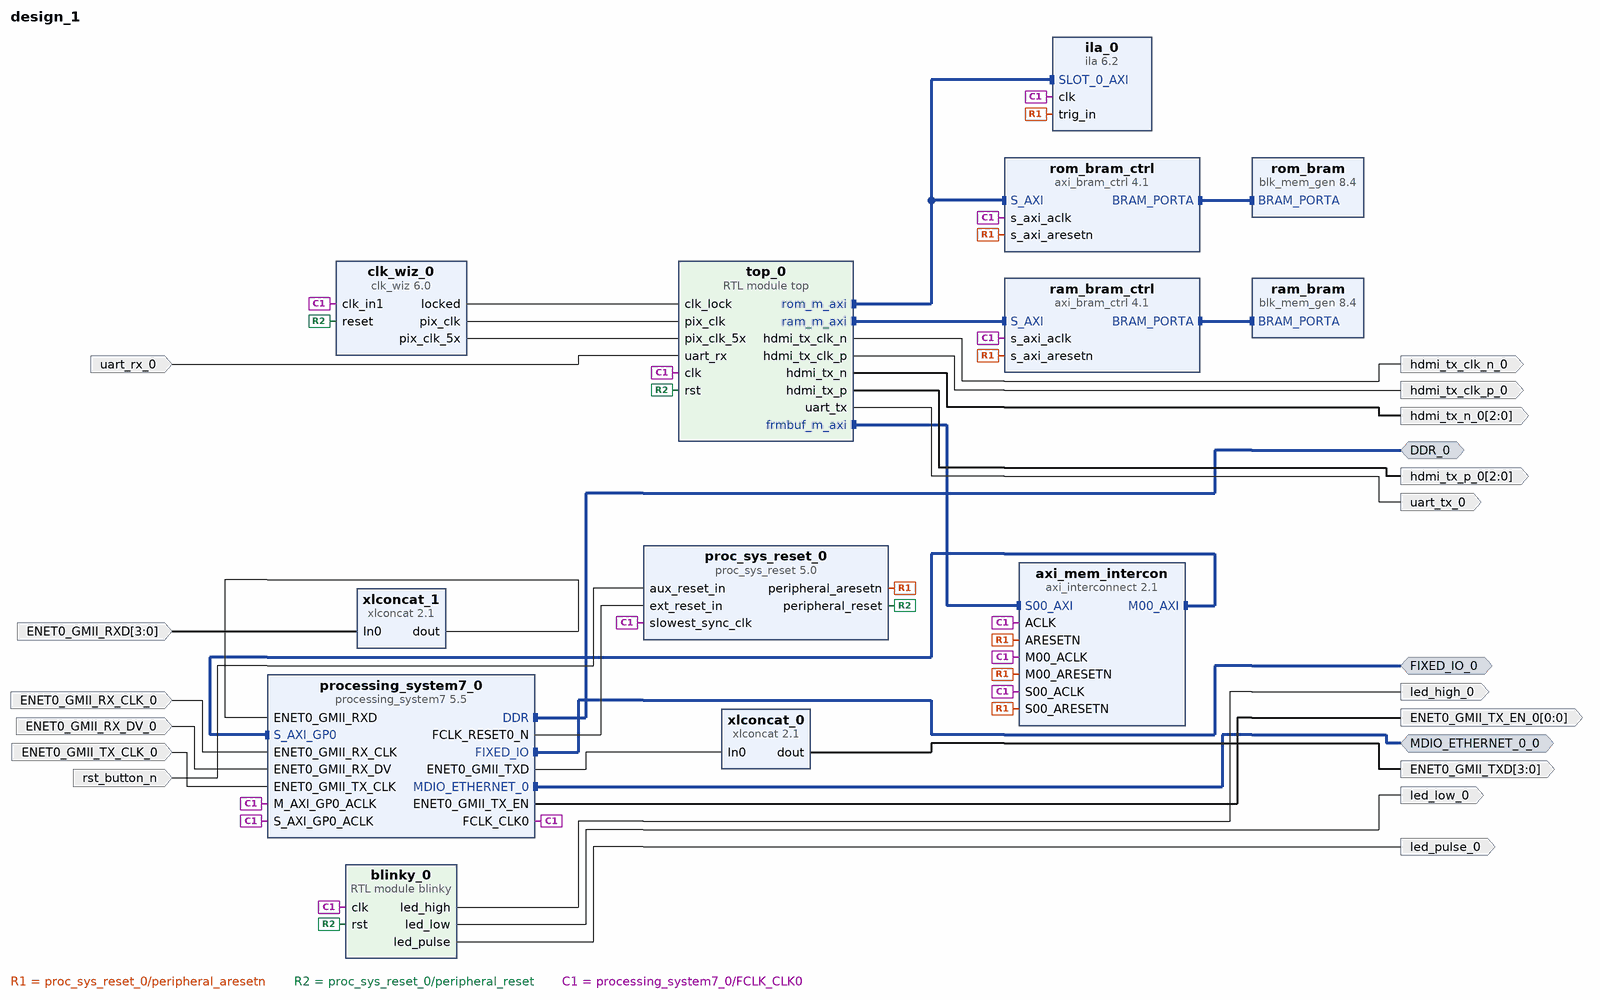
[diagram p0: block diagram of the top level]
# Vivado block design design_1, xc7z010clg400-1, Vivado 2022.2
create_bd_design design_1

create_bd_intf_port -mode Master -vlnv xilinx.com:interface:ddrx_rtl:1.0 DDR_0
create_bd_intf_port -mode Master -vlnv xilinx.com:display_processing_system7:fixedio_rtl:1.0 FIXED_IO_0
create_bd_intf_port -mode Master -vlnv xilinx.com:interface:mdio_rtl:1.0 MDIO_ETHERNET_0_0
create_bd_port -dir I -from 3 -to 0 ENET0_GMII_RXD
create_bd_port -dir I -type clk ENET0_GMII_RX_CLK_0
create_bd_port -dir I ENET0_GMII_RX_DV_0
create_bd_port -dir O -from 3 -to 0 ENET0_GMII_TXD
create_bd_port -dir I -type clk ENET0_GMII_TX_CLK_0
create_bd_port -dir O -from 0 -to 0 ENET0_GMII_TX_EN_0
create_bd_port -dir I uart_rx_0
create_bd_port -dir O uart_tx_0
create_bd_port -dir I -type rst rst_button_n
create_bd_port -dir O led_high_0
create_bd_port -dir O led_pulse_0
create_bd_port -dir O led_low_0
create_bd_port -dir O -from 2 -to 0 hdmi_tx_n_0
create_bd_port -dir O -type clk hdmi_tx_clk_p_0
create_bd_port -dir O -type clk hdmi_tx_clk_n_0
create_bd_port -dir O -from 2 -to 0 hdmi_tx_p_0

create_bd_cell -type ip -vlnv xilinx.com:ip:processing_system7:5.5 processing_system7_0
set_property -dict [list \
  CONFIG.PCW_ENET0_ENET0_IO EMIO \
  CONFIG.PCW_ENET0_GRP_MDIO_ENABLE 1 \
  CONFIG.PCW_ENET0_GRP_MDIO_IO EMIO \
  CONFIG.PCW_ENET0_PERIPHERAL_ENABLE 1 \
  CONFIG.PCW_ENET0_PERIPHERAL_FREQMHZ {100 Mbps} \
  CONFIG.PCW_GPIO_MIO_GPIO_ENABLE 0 \
  CONFIG.PCW_NAND_NAND_IO {MIO 0 2.. 14} \
  CONFIG.PCW_NAND_PERIPHERAL_ENABLE 1 \
  CONFIG.PCW_SD0_GRP_CD_ENABLE 0 \
  CONFIG.PCW_SD0_GRP_WP_ENABLE 0 \
  CONFIG.PCW_SD0_PERIPHERAL_ENABLE 1 \
  CONFIG.PCW_SD0_SD0_IO {MIO 40 .. 45} \
  CONFIG.PCW_SDIO_PERIPHERAL_FREQMHZ 100 \
  CONFIG.PCW_TTC0_PERIPHERAL_ENABLE 1 \
  CONFIG.PCW_TTC0_TTC0_IO EMIO \
  CONFIG.PCW_UART1_PERIPHERAL_ENABLE 1 \
  CONFIG.PCW_UART1_UART1_IO {MIO 24 .. 25} \
  CONFIG.PCW_UART_PERIPHERAL_FREQMHZ 100 \
  CONFIG.PCW_UIPARAM_DDR_BUS_WIDTH {16 Bit} \
  CONFIG.PCW_UIPARAM_DDR_PARTNO {MT41K128M16 HA-15E} \
  CONFIG.PCW_USE_S_AXI_GP0 1 \
] [get_bd_cells processing_system7_0]
# 115 more settings of processing_system7_0 are not shown: defaults, MIO pin electricals, DDR timing, and values the tool derives
create_bd_cell -type ip -vlnv xilinx.com:ip:xlconcat:2.1 xlconcat_0
set_property -dict {CONFIG.IN0_WIDTH 4 CONFIG.NUM_PORTS 1} [get_bd_cells xlconcat_0]
create_bd_cell -type ip -vlnv xilinx.com:ip:xlconcat:2.1 xlconcat_1
set_property -dict {CONFIG.IN0_WIDTH 4 CONFIG.IN1_WIDTH 4} [get_bd_cells xlconcat_1]
create_bd_cell -type ip -vlnv xilinx.com:ip:axi_bram_ctrl:4.1 rom_bram_ctrl
set_property -dict {CONFIG.SINGLE_PORT_BRAM 1} [get_bd_cells rom_bram_ctrl]
create_bd_cell -type ip -vlnv xilinx.com:ip:axi_bram_ctrl:4.1 ram_bram_ctrl
set_property -dict {CONFIG.SINGLE_PORT_BRAM 1} [get_bd_cells ram_bram_ctrl]
create_bd_cell -type ip -vlnv xilinx.com:ip:blk_mem_gen:8.4 rom_bram
set_property -dict [list \
  CONFIG.Coe_File ../../../../../../../rom2.coe \
  CONFIG.Load_Init_File true \
  CONFIG.Memory_Type Single_Port_ROM \
] [get_bd_cells rom_bram]
create_bd_cell -type ip -vlnv xilinx.com:ip:blk_mem_gen:8.4 ram_bram
create_bd_cell -type ip -vlnv xilinx.com:ip:proc_sys_reset:5.0 proc_sys_reset_0
set_property -dict {CONFIG.C_AUX_RST_WIDTH 1 CONFIG.C_EXT_RST_WIDTH 1} [get_bd_cells proc_sys_reset_0]
create_bd_cell -type module -reference blinky blinky_0
create_bd_cell -type ip -vlnv xilinx.com:ip:ila:6.2 ila_0
set_property -dict {CONFIG.C_ADV_TRIGGER false CONFIG.C_TRIGIN_EN true} [get_bd_cells ila_0]
create_bd_cell -type ip -vlnv xilinx.com:ip:axi_interconnect:2.1 axi_mem_intercon
set_property -dict {CONFIG.NUM_MI 1} [get_bd_cells axi_mem_intercon]
create_bd_cell -type ip -vlnv xilinx.com:ip:clk_wiz:6.0 clk_wiz_0
set_property -dict [list \
  CONFIG.CLKOUT1_JITTER 648.308 \
  CONFIG.CLKOUT1_PHASE_ERROR 897.574 \
  CONFIG.CLKOUT1_REQUESTED_OUT_FREQ 63.5 \
  CONFIG.CLKOUT2_JITTER 520.984 \
  CONFIG.CLKOUT2_PHASE_ERROR 897.574 \
  CONFIG.CLKOUT2_REQUESTED_OUT_FREQ 317.5 \
  CONFIG.CLKOUT2_USED true \
  CONFIG.CLK_OUT1_PORT pix_clk \
  CONFIG.CLK_OUT2_PORT pix_clk_5x \
  CONFIG.MMCM_CLKFBOUT_MULT_F 63.500 \
  CONFIG.MMCM_CLKOUT0_DIVIDE_F 10.000 \
  CONFIG.MMCM_CLKOUT1_DIVIDE 2 \
  CONFIG.MMCM_DIVCLK_DIVIDE 5 \
  CONFIG.NUM_OUT_CLKS 2 \
] [get_bd_cells clk_wiz_0]
create_bd_cell -type module -reference top top_0

# ---- connections ----

connect_bd_intf_net -intf_net axi_bram_ctrl_0_BRAM_PORTA [get_bd_intf_pins rom_bram/BRAM_PORTA] [get_bd_intf_pins rom_bram_ctrl/BRAM_PORTA]
connect_bd_intf_net -intf_net axi_bram_ctrl_1_BRAM_PORTA [get_bd_intf_pins ram_bram/BRAM_PORTA] [get_bd_intf_pins ram_bram_ctrl/BRAM_PORTA]
connect_bd_intf_net [get_bd_intf_pins axi_mem_intercon/M00_AXI] [get_bd_intf_pins processing_system7_0/S_AXI_GP0]
connect_bd_intf_net [get_bd_intf_ports DDR_0] [get_bd_intf_pins processing_system7_0/DDR]
connect_bd_intf_net [get_bd_intf_ports FIXED_IO_0] [get_bd_intf_pins processing_system7_0/FIXED_IO]
connect_bd_intf_net [get_bd_intf_ports MDIO_ETHERNET_0_0] [get_bd_intf_pins processing_system7_0/MDIO_ETHERNET_0]
connect_bd_intf_net [get_bd_intf_pins top_0/frmbuf_m_axi] [get_bd_intf_pins axi_mem_intercon/S00_AXI]
connect_bd_intf_net [get_bd_intf_pins ram_bram_ctrl/S_AXI] [get_bd_intf_pins top_0/ram_m_axi]
connect_bd_intf_net [get_bd_intf_pins rom_bram_ctrl/S_AXI] [get_bd_intf_pins top_0/rom_m_axi]
connect_bd_intf_net [get_bd_intf_pins rom_bram_ctrl/S_AXI] [get_bd_intf_pins ila_0/SLOT_0_AXI]
connect_bd_net -net ENET0_GMII_RX_CLK_0_1 [get_bd_ports ENET0_GMII_RX_CLK_0] [get_bd_pins processing_system7_0/ENET0_GMII_RX_CLK]
connect_bd_net -net ENET0_GMII_RX_DV_0_1 [get_bd_ports ENET0_GMII_RX_DV_0] [get_bd_pins processing_system7_0/ENET0_GMII_RX_DV]
connect_bd_net -net ENET0_GMII_TX_CLK_0_1 [get_bd_ports ENET0_GMII_TX_CLK_0] [get_bd_pins processing_system7_0/ENET0_GMII_TX_CLK]
connect_bd_net -net In0_0_1 [get_bd_ports ENET0_GMII_RXD] [get_bd_pins xlconcat_1/In0]
connect_bd_net -net aux_reset_in_0_1 [get_bd_ports rst_button_n] [get_bd_pins proc_sys_reset_0/aux_reset_in]
connect_bd_net [get_bd_pins blinky_0/led_high] [get_bd_ports led_high_0]
connect_bd_net [get_bd_pins blinky_0/led_low] [get_bd_ports led_low_0]
connect_bd_net [get_bd_pins blinky_0/led_pulse] [get_bd_ports led_pulse_0]
connect_bd_net [get_bd_pins clk_wiz_0/locked] [get_bd_pins top_0/clk_lock]
connect_bd_net [get_bd_pins clk_wiz_0/pix_clk] [get_bd_pins top_0/pix_clk]
connect_bd_net [get_bd_pins clk_wiz_0/pix_clk_5x] [get_bd_pins top_0/pix_clk_5x]
connect_bd_net [get_bd_pins proc_sys_reset_0/peripheral_aresetn] \
  [get_bd_pins ram_bram_ctrl/s_axi_aresetn] [get_bd_pins rom_bram_ctrl/s_axi_aresetn] [get_bd_pins ila_0/trig_in] \
  [get_bd_pins axi_mem_intercon/S00_ARESETN] [get_bd_pins axi_mem_intercon/M00_ARESETN] \
  [get_bd_pins axi_mem_intercon/ARESETN]
connect_bd_net [get_bd_pins proc_sys_reset_0/peripheral_reset] [get_bd_pins blinky_0/rst] [get_bd_pins clk_wiz_0/reset] [get_bd_pins top_0/rst]
connect_bd_net [get_bd_pins processing_system7_0/ENET0_GMII_TXD] [get_bd_pins xlconcat_0/In0]
connect_bd_net [get_bd_pins processing_system7_0/ENET0_GMII_TX_EN] [get_bd_ports ENET0_GMII_TX_EN_0]
connect_bd_net [get_bd_pins processing_system7_0/FCLK_CLK0] \
  [get_bd_pins processing_system7_0/M_AXI_GP0_ACLK] [get_bd_pins rom_bram_ctrl/s_axi_aclk] \
  [get_bd_pins ram_bram_ctrl/s_axi_aclk] [get_bd_pins proc_sys_reset_0/slowest_sync_clk] [get_bd_pins blinky_0/clk] \
  [get_bd_pins ila_0/clk] [get_bd_pins axi_mem_intercon/S00_ACLK] [get_bd_pins processing_system7_0/S_AXI_GP0_ACLK] \
  [get_bd_pins axi_mem_intercon/M00_ACLK] [get_bd_pins axi_mem_intercon/ACLK] [get_bd_pins clk_wiz_0/clk_in1] \
  [get_bd_pins top_0/clk]
connect_bd_net [get_bd_pins processing_system7_0/FCLK_RESET0_N] [get_bd_pins proc_sys_reset_0/ext_reset_in]
connect_bd_net [get_bd_pins top_0/hdmi_tx_clk_n] [get_bd_ports hdmi_tx_clk_n_0]
connect_bd_net [get_bd_pins top_0/hdmi_tx_clk_p] [get_bd_ports hdmi_tx_clk_p_0]
connect_bd_net [get_bd_pins top_0/hdmi_tx_n] [get_bd_ports hdmi_tx_n_0]
connect_bd_net [get_bd_pins top_0/hdmi_tx_p] [get_bd_ports hdmi_tx_p_0]
connect_bd_net [get_bd_pins top_0/uart_tx] [get_bd_ports uart_tx_0]
connect_bd_net -net uart_rx_0_1 [get_bd_ports uart_rx_0] [get_bd_pins top_0/uart_rx]
connect_bd_net [get_bd_pins xlconcat_0/dout] [get_bd_ports ENET0_GMII_TXD]
connect_bd_net [get_bd_pins xlconcat_1/dout] [get_bd_pins processing_system7_0/ENET0_GMII_RXD]

# ---- address map ----
assign_bd_address -offset 0x00000000 -range 256M -target_address_space [get_bd_addr_spaces top_0/frmbuf_m_axi] [get_bd_addr_segs processing_system7_0/S_AXI_GP0/GP0_DDR_LOWOCM]
assign_bd_address -offset 0x40000000 -range 1G -target_address_space [get_bd_addr_spaces top_0/frmbuf_m_axi] [get_bd_addr_segs processing_system7_0/S_AXI_GP0/GP0_M_AXI_GP0]
assign_bd_address -offset 0xE0000000 -range 4M -target_address_space [get_bd_addr_spaces top_0/frmbuf_m_axi] [get_bd_addr_segs processing_system7_0/S_AXI_GP0/GP0_IOP]
assign_bd_address -offset 0xE1000000 -range 16M -target_address_space [get_bd_addr_spaces top_0/frmbuf_m_axi] [get_bd_addr_segs processing_system7_0/S_AXI_GP0/GP0_NAND]
assign_bd_address -offset 0x00000000 -range 16K -target_address_space [get_bd_addr_spaces top_0/ram_m_axi] [get_bd_addr_segs ram_bram_ctrl/S_AXI/Mem0]
assign_bd_address -offset 0xFFFE0000 -range 64K -target_address_space [get_bd_addr_spaces top_0/rom_m_axi] [get_bd_addr_segs rom_bram_ctrl/S_AXI/Mem0]

validate_bd_design
save_bd_design
